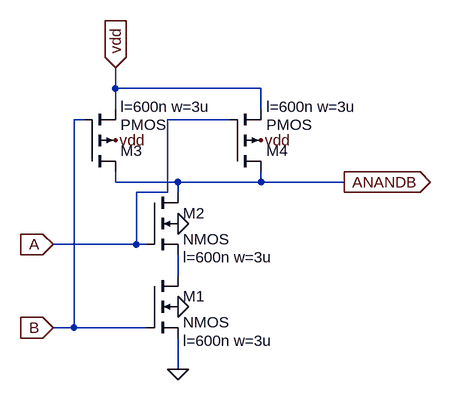
[diagram p0: schematic NAND_2.asc]
NAND_2.asc, the LTspice schematic file:
Version 4
SHEET 1 880 680
WIRE 176 -96 176 -128
WIRE 400 -96 176 -96
WIRE 176 -64 176 -96
WIRE 400 -64 400 -96
WIRE 128 -48 112 -48
WIRE 352 -48 256 -48
WIRE 176 48 176 32
WIRE 272 48 176 48
WIRE 400 48 400 32
WIRE 400 48 272 48
WIRE 528 48 400 48
WIRE 256 64 256 -48
WIRE 256 64 208 64
WIRE 272 64 272 48
WIRE 208 144 208 64
WIRE 208 144 80 144
WIRE 224 144 208 144
WIRE 272 192 272 160
WIRE 112 272 112 -48
WIRE 112 272 80 272
WIRE 224 272 112 272
WIRE 272 336 272 288
FLAG 272 336 0
FLAG 272 240 0
FLAG 272 112 0
FLAG 80 144 A
IOPIN 80 144 In
FLAG 80 272 B
IOPIN 80 272 In
FLAG 176 -128 vdd
IOPIN 176 -128 In
FLAG 176 -16 vdd
FLAG 400 -16 vdd
FLAG 528 48 ANANDB
IOPIN 528 48 Out
SYMBOL nmos4 224 192 R0
WINDOW 123 56 100 Left 2
SYMATTR InstName M1
SYMATTR Value2 l=600n w=3u
SYMBOL nmos4 224 64 R0
WINDOW 123 56 100 Left 2
SYMATTR InstName M2
SYMATTR Value2 l=600n w=3u
SYMBOL pmos4 128 32 M180
WINDOW 123 56 100 Left 2
SYMATTR InstName M3
SYMATTR Value2 l=600n w=3u
SYMBOL pmos4 352 32 M180
WINDOW 123 56 100 Left 2
SYMATTR InstName M4
SYMATTR Value2 l=600n w=3u

The netlist it stands for:
* NAND_2.asc
M1 N001 B 0 0 NMOS l=600n w=3u
M2 ANANDB A N001 0 NMOS l=600n w=3u
M3 ANANDB B vdd vdd PMOS l=600n w=3u
M4 ANANDB A vdd vdd PMOS l=600n w=3u
.model NMOS NMOS
.model PMOS PMOS
.lib standard.mos
.backanno
.end